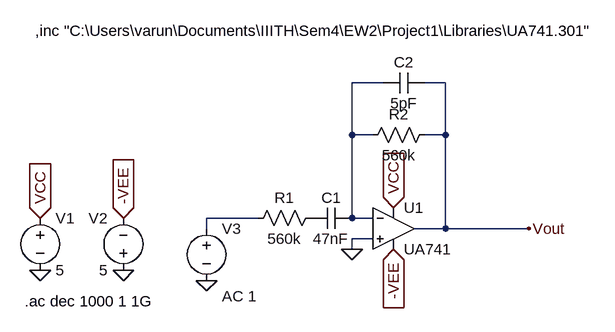
[diagram p0: schematic Filter_Stage.asc]
Filter_Stage.asc, the LTspice schematic file:
Version 4
SHEET 1 880 680
WIRE 304 -128 256 -128
WIRE 400 -128 368 -128
WIRE 256 -48 256 -128
WIRE 288 -48 256 -48
WIRE 400 -48 400 -128
WIRE 400 -48 368 -48
WIRE 112 80 32 80
WIRE 256 80 256 -48
WIRE 288 80 256 80
WIRE 32 96 32 80
WIRE 400 96 400 -48
WIRE 400 96 352 96
WIRE 528 96 400 96
WIRE 288 112 256 112
WIRE 256 128 256 112
FLAG -224 80 VCC
IOPIN -224 80 In
FLAG -96 160 0
FLAG -224 160 0
FLAG -96 80 -VEE
IOPIN -96 80 In
FLAG 320 64 VCC
IOPIN 320 64 In
FLAG 320 128 -VEE
IOPIN 320 128 In
FLAG 528 96 Vout
FLAG 256 128 0
FLAG 32 176 0
SYMBOL OpAmps\\opamp2 320 32 R0
SYMATTR InstName U1
SYMATTR Value UA741
SYMBOL voltage -224 64 R0
SYMATTR InstName V1
SYMATTR Value 5
SYMBOL voltage -96 176 R180
WINDOW 0 24 96 Left 2
WINDOW 3 24 16 Left 2
SYMATTR InstName V2
SYMATTR Value 5
SYMBOL res 208 64 R90
WINDOW 0 0 56 VBottom 2
WINDOW 3 32 56 VTop 2
SYMATTR InstName R1
SYMATTR Value 560k
SYMBOL cap 256 64 R90
WINDOW 0 0 32 VBottom 2
WINDOW 3 32 32 VTop 2
SYMATTR InstName C1
SYMATTR Value 47nF
SYMBOL res 384 -64 R90
WINDOW 0 0 56 VBottom 2
WINDOW 3 32 56 VTop 2
SYMATTR InstName R2
SYMATTR Value 560k
SYMBOL cap 368 -144 R90
WINDOW 0 0 32 VBottom 2
WINDOW 3 32 32 VTop 2
SYMATTR InstName C2
SYMATTR Value 5pF
SYMBOL voltage 32 80 R0
WINDOW 123 24 120 Left 2
WINDOW 39 0 0 Left 0
SYMATTR Value2 AC 1
SYMATTR InstName V3
SYMATTR Value ""
TEXT -248 208 Left 2 !.ac dec 1000 1 1G
TEXT -232 -208 Left 2 !,inc "C:\\Users\\varun\\Documents\\IIITH\\Sem4\\EW2\\Project1\\Libraries\\UA741.301"

The netlist it stands for:
* Filter_Stage.asc
XU1 0 N001 VCC -VEE Vout UA741  ; pins In+ In- V+ V- OUT
V1 VCC 0 5
V2 0 -VEE 5
R1 P001 N002 560k
C1 N001 P001 47nF
R2 Vout N001 560k
C2 Vout N001 5pF
V3 N002 0 AC 1
.ac dec 1000 1 1G
,inc "C:\Users\varun\Documents\IIITH\Sem4\EW2\Project1\Libraries\UA741.301"
.backanno
.end